# EAGLE design H2BR2 (EAGLE 9.6.1)

## Sheet 1 of 2
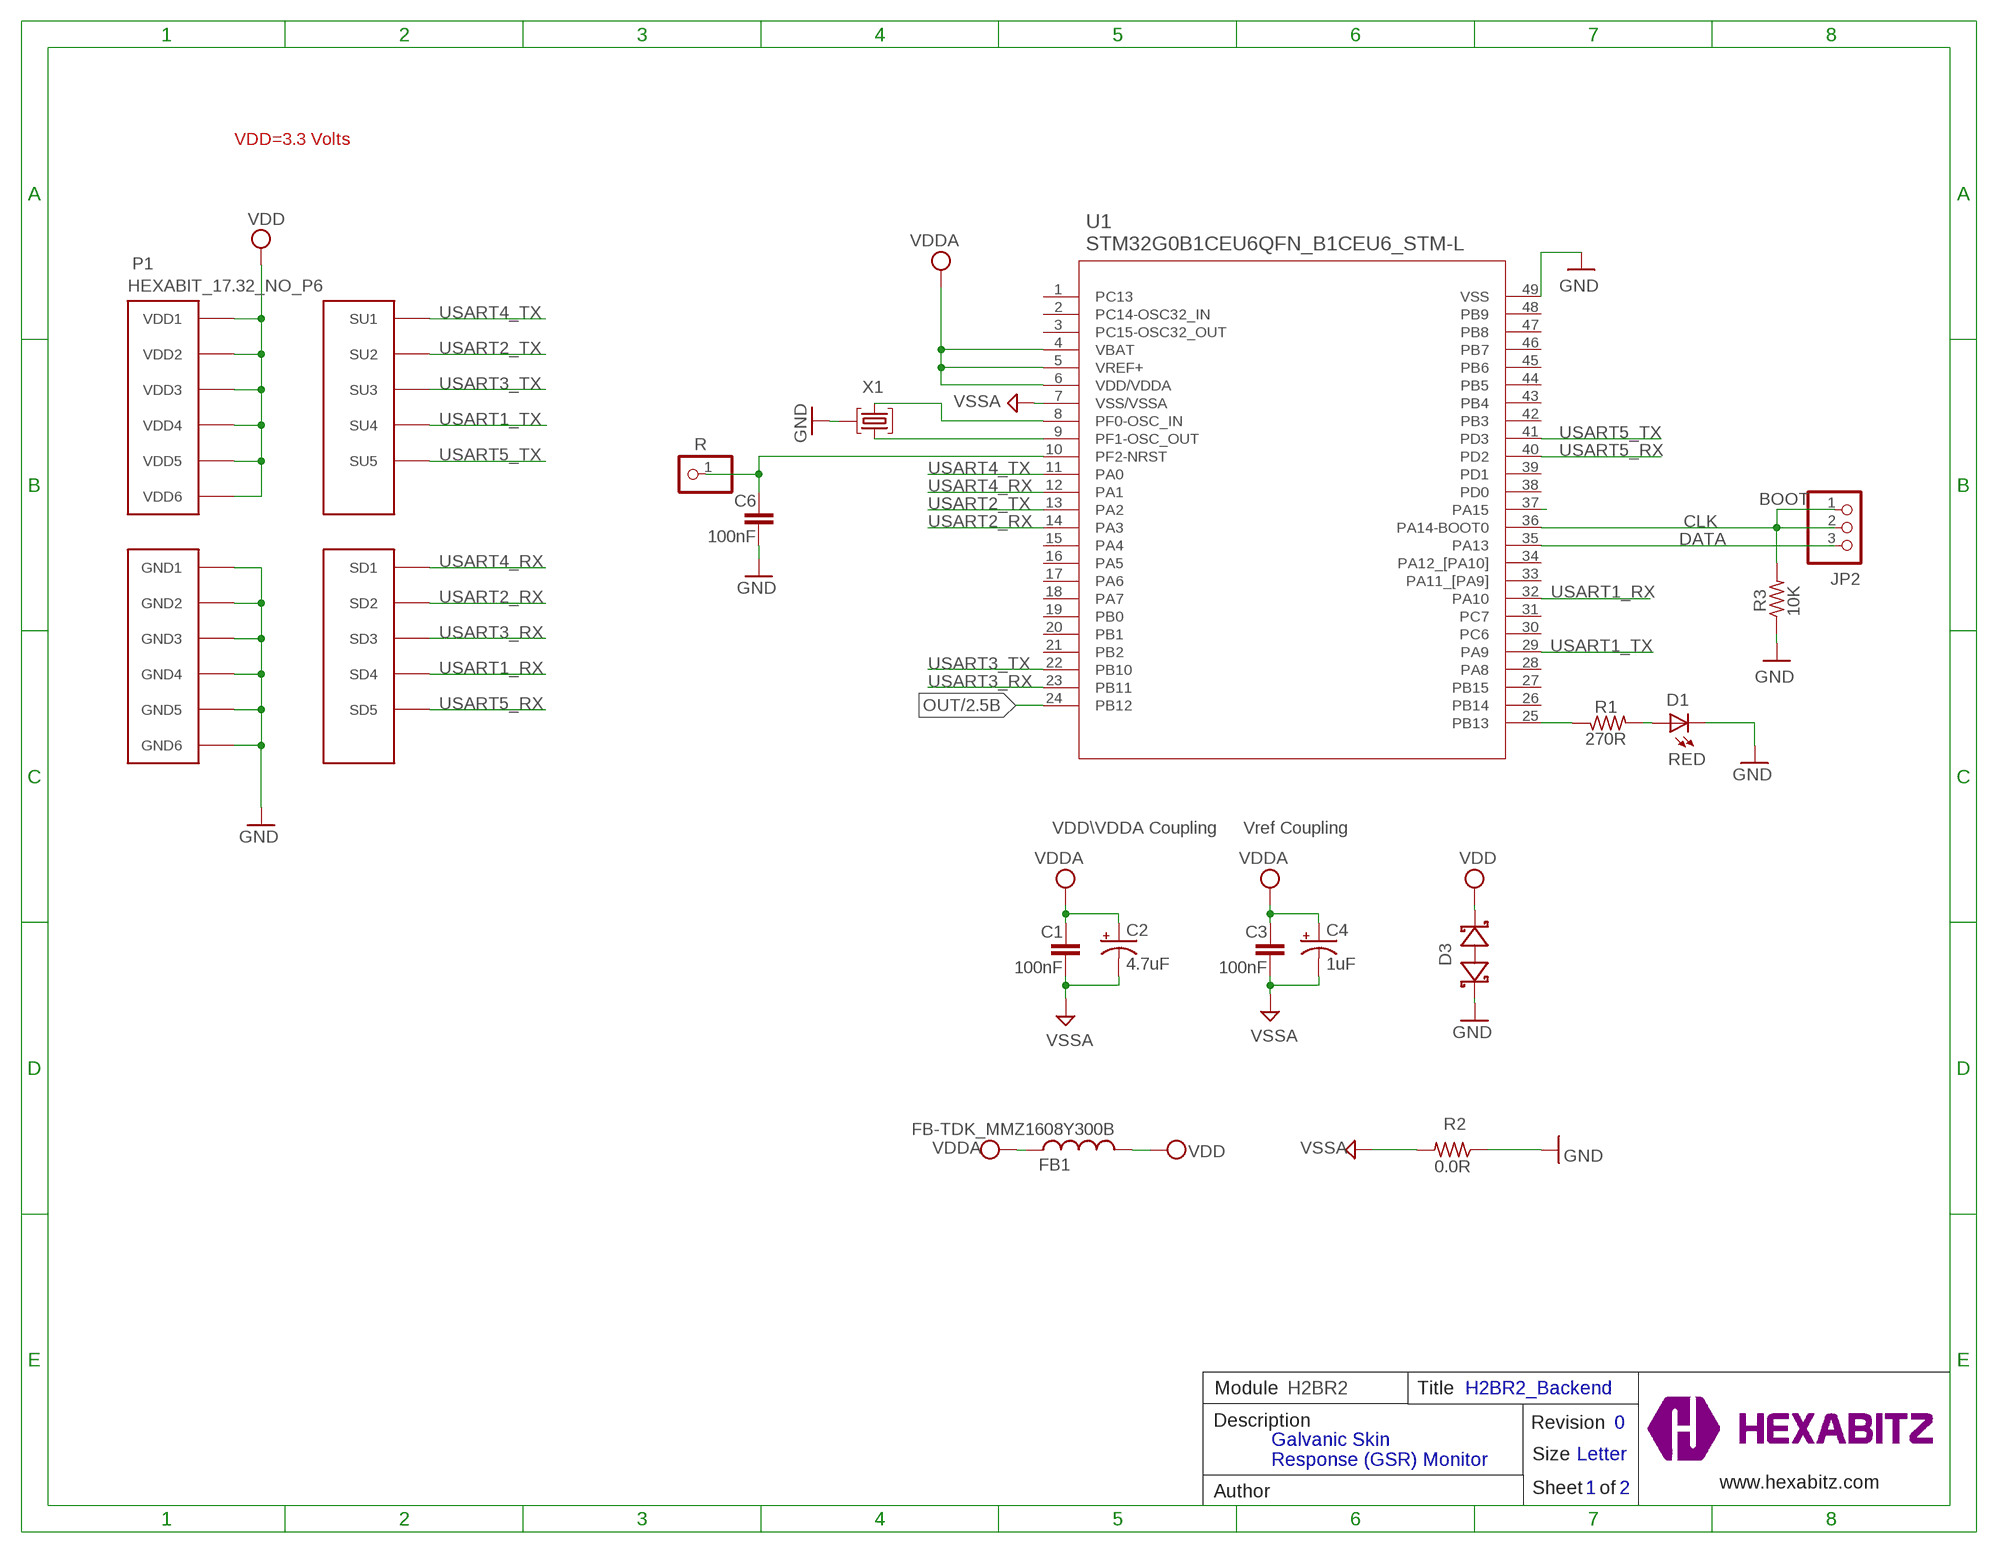
[diagram p0: schematic, sheet 1]

### Parts
C1  100nF  C-0603  [C-0603]
C2  4.7uF  C-0805-POL  [C-0805-POL]
C3  100nF  C-0603  [C-0603]
C4  1uF  C-0805-POL  [C-0805-POL]
C6  100nF  C-0603  [C-0603]
D1  RED  VLMS1300-GS08  [VLMS1300-GS08]
D3  BOURNS_CDSOD323-T03SCBOURNS_CDSOD323-T03SC_0_0  [BOURNS_CDSOD323-T03SC_0]
FB1  FB-TDK_MMZ1608Y300B  FB-0603  [FB-0603]
JP1  R  PINHD-1X1  [1X01]
JP2  PINHD-1X3  [1X03]
P1  HEXABIT_17.32_NO_P6  [HEXABIT_17.32_NO_P6]
R1  270R  R-0603  [R-0603]
R2  0.0R  R-0603  [R-0603]
R3  10K  R-0603  [R-0603]
TRIMBLE-LOGO1  HEXA-LOGO  [HEXA-LOGO]
U1  STM32G0B1CEU6QFN_B1CEU6_STM-L  [QFN_B1CEU6_STM-L]
X1  XTALL_CSTCE8M00G52  [XTALL_CSTCE8M00G52]

### Nets
CLK: JP2.1 JP2.2 R3.2 U1.36(PA14-BOOT0)
DATA: JP2.3 U1.35(PA13)
GND: C6.2 D1.C D3.1(A) P1.PAD_PD7(GND1) P1.PAD_PD8(GND2) P1.PAD_PD9(GND3) P1.PAD_PD10(GND4) P1.PAD_PD11(GND5) P1.PAD_PD12(GND6) R2.1 R3.1 U1.49(VSS) X1.P$2 ; also sheet 2
N$1: R1.1 U1.25(PB13)
N$3: D1.A R1.2
N$4: C6.1 JP1.1 U1.10(PF2-NRST)
N$5: U1.9(PF1-OSC_OUT) X1.P$1
N$6: U1.8(PF0-OSC_IN) X1.P$3
N$9: U1.37(PA15)
OUT: U1.24(PB12) ; also sheet 2
USART1_RX: P1.PAD_PD4(SD4) U1.32(PA10)
USART1_TX: P1.PAD_PU4(SU4) U1.29(PA9)
USART2_RX: P1.PAD_PD2(SD2) U1.14(PA3)
USART2_TX: P1.PAD_PU2(SU2) U1.13(PA2)
USART3_RX: P1.PAD_PD3(SD3) U1.23(PB11)
USART3_TX: P1.PAD_PU3(SU3) U1.22(PB10)
USART4_RX: P1.PAD_PD1(SD1) U1.12(PA1)
USART4_TX: P1.PAD_PU1(SU1) U1.11(PA0)
USART5_RX: P1.PAD_PD5(SD5) U1.40(PD2)
USART5_TX: P1.PAD_PU5(SU5) U1.41(PD3)
VDD: D3.2(C) FB1.2 P1.PAD_PU7(VDD1) P1.PAD_PU8(VDD2) P1.PAD_PU9(VDD3) P1.PAD_PU10(VDD4) P1.PAD_PU11(VDD5) P1.PAD_PU12(VDD6) ; also sheet 2
VDDA: C1.1 C2.1(+) C3.1 C4.1(+) FB1.1 U1.4(VBAT) U1.5(VREF+) U1.6(VDD/VDDA)
VSSA: C1.2 C2.2(-) C3.2 C4.2(-) R2.2 U1.7(VSS/VSSA)
Unconnected: U1.1(PC13) U1.2(PC14-OSC32_IN) U1.3(PC15-OSC32_OUT) U1.15(PA4) U1.16(PA5) U1.17(PA6) U1.18(PA7) U1.19(PB0) U1.20(PB1) U1.21(PB2) U1.26(PB14) U1.27(PB15) U1.28(PA8) U1.30(PC6) U1.31(PC7) U1.33(PA11_[PA9]) U1.34(PA12_[PA10]) U1.38(PD0) U1.39(PD1) U1.42(PB3) U1.43(PB4) U1.44(PB5) U1.45(PB6) U1.46(PB7) U1.47(PB8) U1.48(PB9)

### Notes on the sheet
- VDD=3.3 Volts
- BOOT
- VDD\VDDA Coupling | Vref Coupling
- Module | H2BR2 | Title | H2BR2_Backend
- Description | Revision | 0
- Size | Letter
- Galvanic Skin
  Response (GSR) Monitor
- www.hexabitz.com
- Author | Sheet   of | 1 | 2
- C:/Users/Admin/Desktop/logodraft.bmp

## Sheet 2 of 2
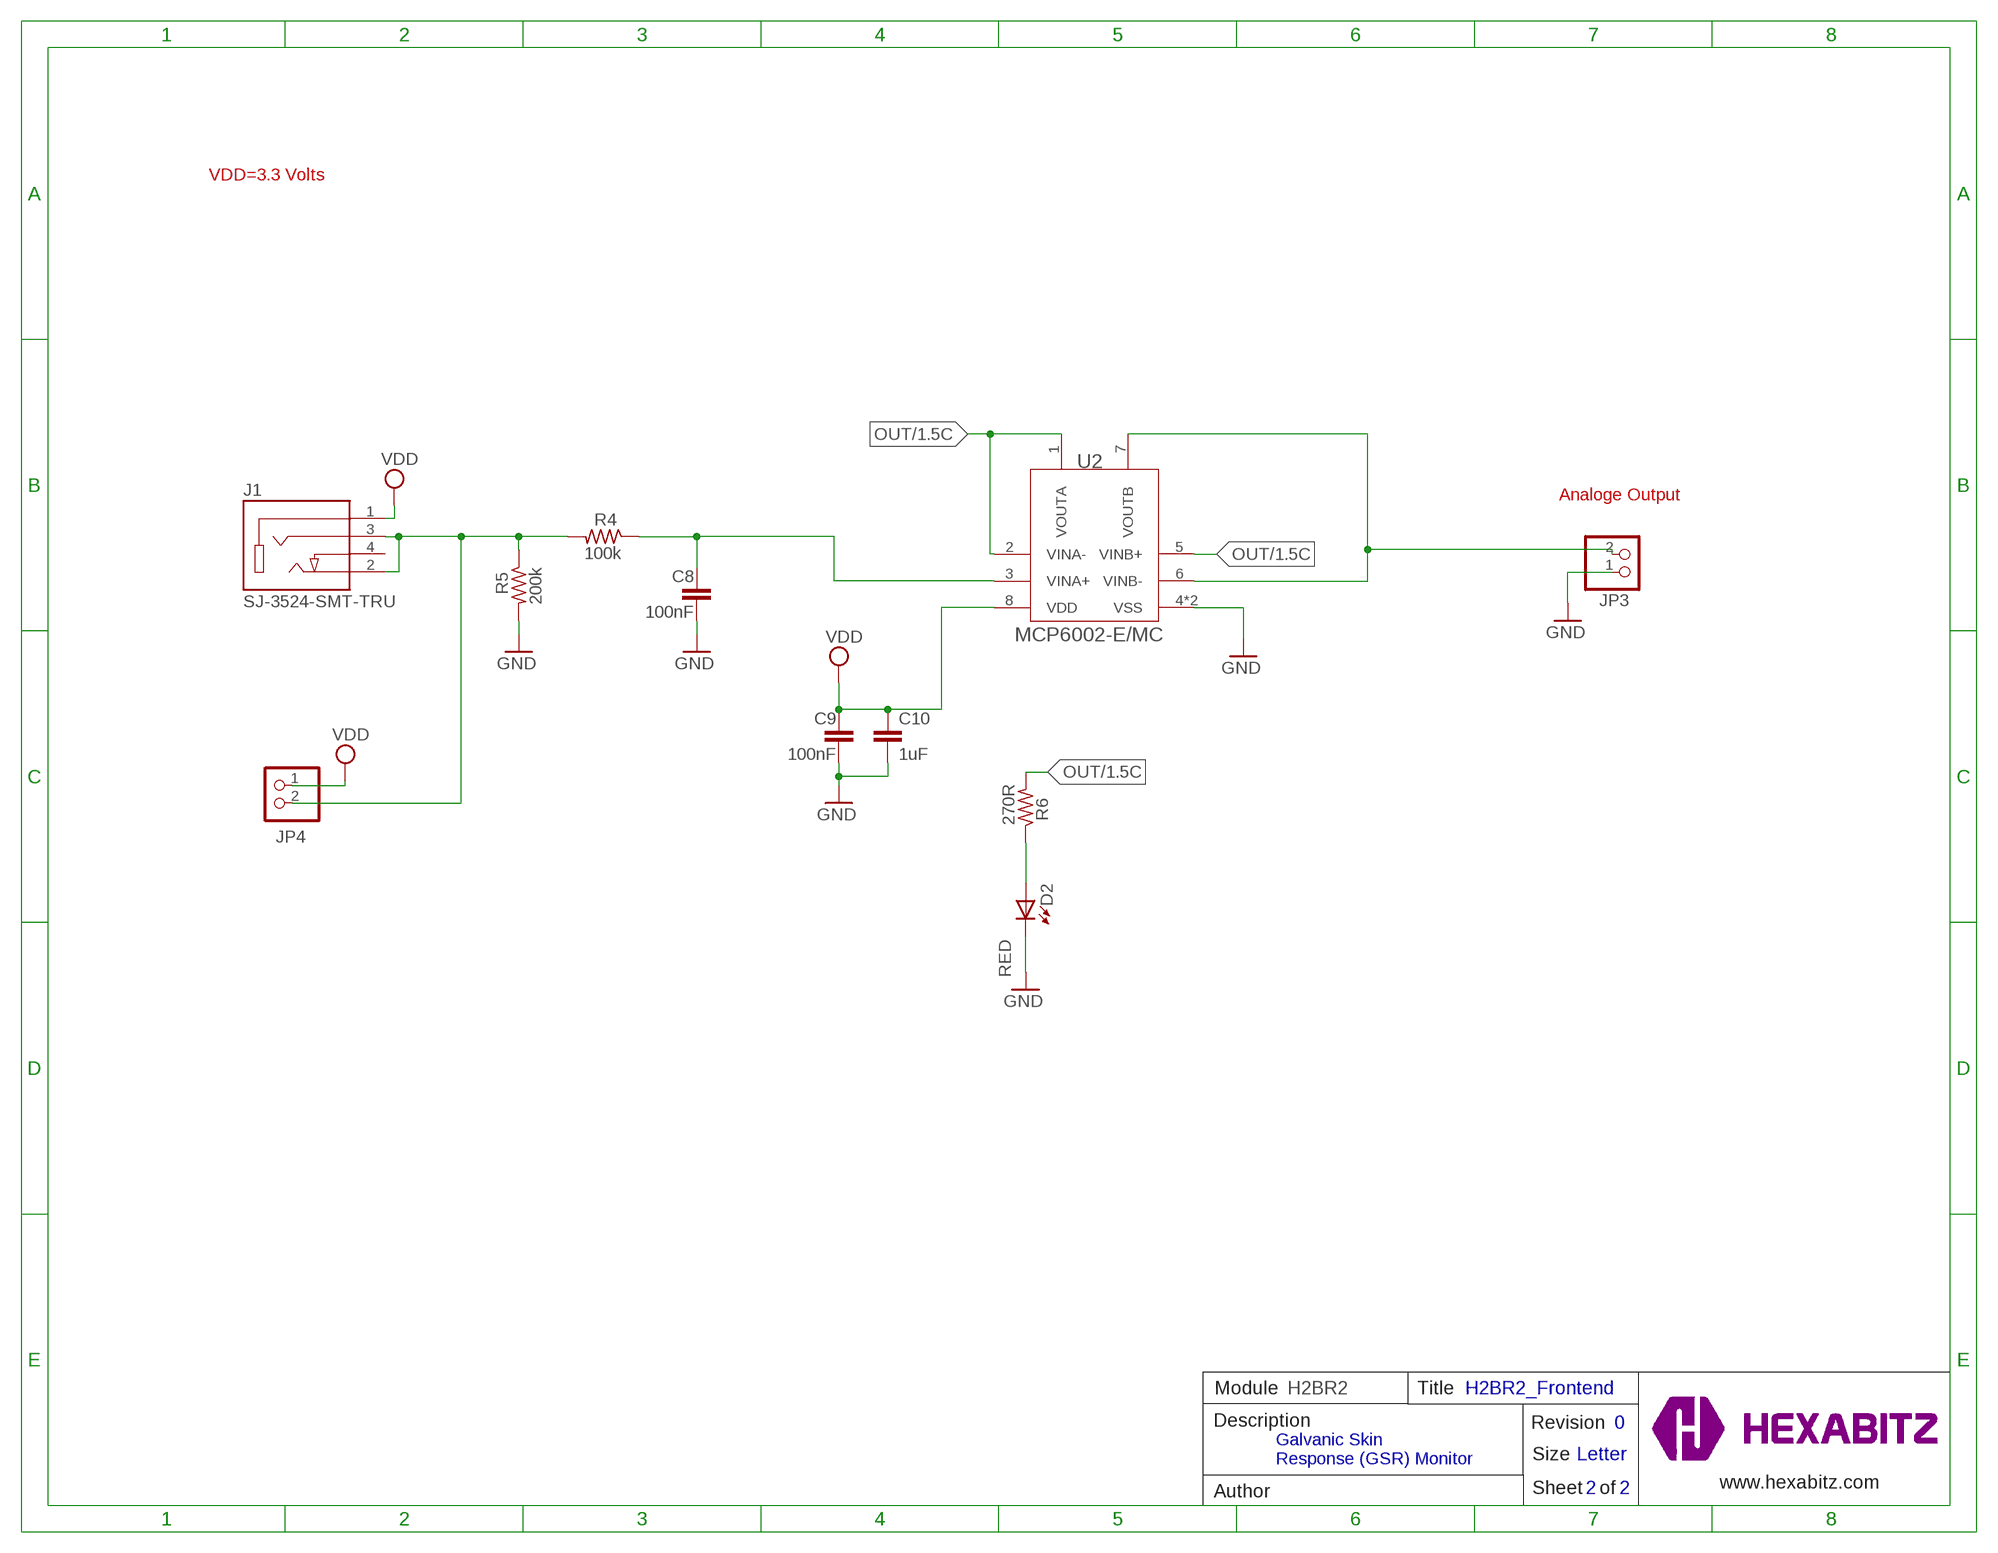
[diagram p1: schematic, sheet 2]

### Parts
C8  100nF  C-0603  [C-0603]
C9  100nF  C-0603  [C-0603]
C10  1uF  C-0805  [C-0805]
D2  RED  VLMS1300-GS08  [VLMS1300-GS08]
J1  SJ-3524-SMT-TRU  [CUI_SJ-3524-SMT]
JP3  PINHD-1X2(ROUND)  [1X02]
JP4  PINHD-1X2(ROUND)  [1X02]
R4  100k  R-0603  [R-0603]
R5  200k  R-0603  [R-0603]
R6  270R  R-0603  [R-0603]
U2  MCP6002-E/MC  [SON50P200X300X100-9N]

### Nets
GND: C8.2 C9.2 C10.2 D2.C JP3.1 R5.2 U2.4(VSS) U2.9(VSS) ; also sheet 1
N$2: JP3.2 U2.6(VINB-) U2.7(VOUTB)
N$8: C8.1 R4.1 U2.3(VINA+)
N$10: J1.2 J1.3 JP4.2 R4.2 R5.1
N$23: D2.A R6.1
OUT: R6.2 U2.1(VOUTA) U2.2(VINA-) U2.5(VINB+) ; also sheet 1
VDD: C9.1 C10.1 J1.1 JP4.1 U2.8(VDD) ; also sheet 1
Unconnected: J1.4

### Notes on the sheet
- VDD=3.3 Volts
- Analoge Output
- Module | H2BR2 | Title | H2BR2_Frontend
- Description | Revision | 0
- Size | Letter
- Galvanic Skin
  Response (GSR) Monitor
- www.hexabitz.com
- Author | Sheet   of | 2 | 2

## Library data of the parts
C1 C3 C6 C8 C9 = HEXABITZ_RCLS:C-0603: CAP CER 10% X7R 0603
C2 C4 = HEXABITZ_RCLS:C-0805-POL: Cap Tant Solid SMD 2012
C10 = HEXABITZ_RCLS:C-0805: CAP CER 10% X7R 0805
D1 D2 = Hexabitz:VLMS1300-GS08: Red 0603 130° Clear 54 mcd 2 V Surface Mount ChipLED ; Octopart Url : http://octopart.com/vlms1300-gs08-vishay-21709201; MFN: Vishay; MPN: VLMS1300-GS08; OCTOPART_URL: https://octopart.com/vlms1300-gs08-vishay-21709201?r=sp&s=_gcP4_q8T1SC6PJQPTQ9yA
D3 = HEXABITZ_RCLS:BOURNS_CDSOD323-T03SC: CDSOD323-TxxSC - TVS Diode Series; DESCRIPTION: Dio Tvs Vwm 03V 500W Bidir Sod323 / Tape & Reel - 7" Reel; MFN: Bourns; MPN: CDSOD323-T03SC; OCTOPART_URL: https://octopart.com/cdsod323-t03sc-bourns-10487153?r=sp
FB1 = HEXABITZ_RCLS:FB-0603: Ferrite Beads Multi-Layer 0603; MFN: TDK; MPN: MMZ1608Y300B; OCTOPART_URL: https://octopart.com/mmz1608y300b-tdk-368280?r=sp&s=cd9_2ZEqQ9q9UNBuQgHAiA
J1 = HEXABITZ_ICs:SJ-3524-SMT-TR: https://octopart.com/search?q=SJ-3524-SMT-TR&currency=USD&specs=0; AVAILABILITY: In Stock; DESCRIPTION: CONN JACK STEREO 3.5MM SMD R/A; MNF: CUI Devices; MPN: SJ-3524-SMT-TR; OCTOPART_URL: https://octopart.com/search?q=SJ-3524-SMT-TR&currency=USD&specs=0; PRICE: 1.03
JP1 = HEXABITZ_USER_INTERFACE_PARTS:PINHD-1X1: PIN HEADER; MFN: TE Connectivity; MPN: 87227-1; OCTOPART_URL: https://octopart.com/87227-1-te+connectivity-39512052?r=sp
JP2 = pinhead:PINHD-1X3: PIN HEADER
JP3 JP4 = pinhead:PINHD-1X2(ROUND): PIN HEADER
P1 = hexabitz_connectors:HEXABIT_?_NO_P6: Hexabitz Hexagon Module Connector Hexagon side length = 17.32mm. The following ports are removed: P6
R1 R3-R6 = HEXABITZ_RCLS:R-0603: Thick Film Resistors - SMD 0603
R2 = HEXABITZ_RCLS:R-0603: Thick Film Resistors - SMD 0603; MFN: Yageo; MPN: RC0603JR-070RL; OCTOPART_URL: https://octopart.com/rc0603jr-070rl-yageo-1241539?r=sp&s=X2NteqRjRNWrnx42Y0aliA; RESISTANCE: 0.0 Ohm
TRIMBLE-LOGO1 = HEXABITZ_USER_INTERFACE_PARTS:HEXA-LOGO: Trimble-Logo
U1 = HEXABITZ_ICs:STM32G0B1CEU6; COPYRIGHT: Copyright (C) 2021 Ultra Librarian. All rights reserved.; MANUFACTURER_PART_NUMBER: STM32G0B1CEU6; MFR_NAME: STMicroelectronics
U2 = HEXABITZ_ICs:MCP6002-E/MC
X1 = Hexabitz:XTALL_CSTCE8M00G52: MURATA CSTCE8M00G52-R0 RESONATOR, SMD, 8MHZ ; Octopart Url : https://octopart.com/cstce8m00g52-r0-murata-7145559; MFN: Murata; MPN: CSTCE8M00G52Z-R0; OCTOPART_URL: https://octopart.com/cstce8m00g52z-r0-murata-17755941?r=sp&s=JDnNJnrHQhyS8Zk4ofFWXw

## Board
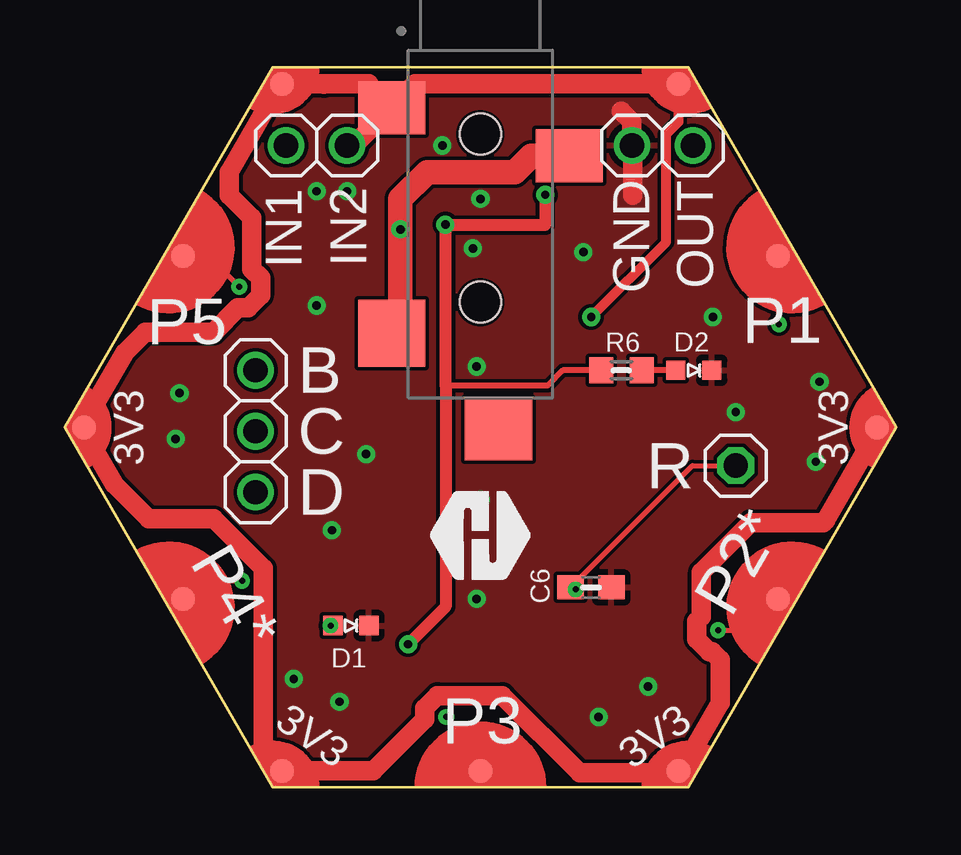
[diagram p2: board, top side]
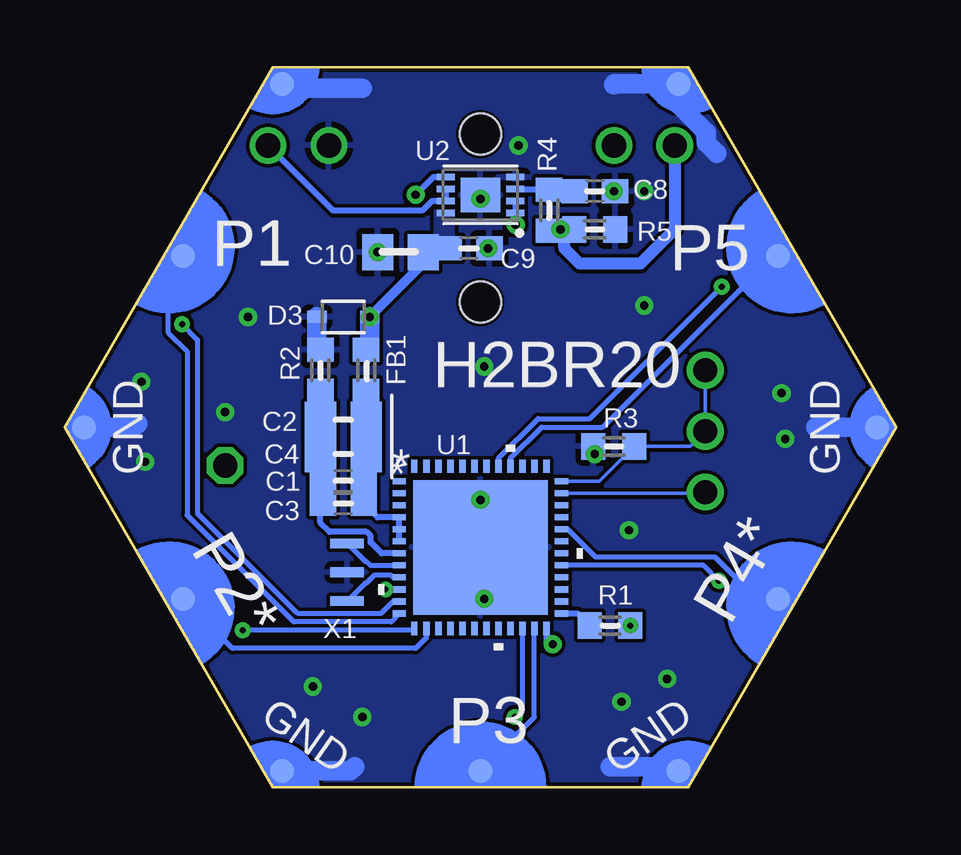
[diagram p3: board, bottom side, seen from below]

Size 34.64 x 30 mm. Coordinates in mm from the lower left corner, seen from the top.
Copper layers (1*16): Top 0.035mm / dielectric 1.5mm / Bottom 0.035mm
Design rules "Ibrahim *": minimum track width 6mil, minimum drill 0.25mm, track to track 6mil, track to pad 6mil, pad to pad 6mil, via to via 6mil, smd to smd 0mil, copper to edge 0.15mm, drill to drill 6mil, minimum pad ring 10mil, minimum via ring 8mil, stop-mask expansion 4mil, vias tented up to drill 24mil, thermal gap 10mil

### Footprints (pad centres in the part's own frame; a part is rotated, then mirrored left to right if it is on the bottom)
C-0603 = smd 1.1 x 1: 1 -0.85,0; 2 0.85,0
C-0805-POL = smd 1.3 x 1.5: 1 -0.95,0; 2 0.95,0
C-0805 = smd 1.3 x 1.5: 1 -0.95,0; 2 0.95,0
VLMS1300-GS08 = smd 0.8 x 0.8: A 0,0.75; C 0,-0.75
BOURNS_CDSOD323-T03SC_0 = smd 0.8 x 0.5: 1 -1.1,0; 2 1.1,0
FB-0603 = smd 1 x 1.1: 1 -0.85,0; 2 0.85,0
CUI_SJ-3524-SMT = smd 2.2 x 2.8: 1 -1.1,-3.7; 3 0.9,3.7 | smd 2.8 x 2.8: 2 8.3,-3.7 | smd 2.6 x 2.8: 4 12.3,0.75 | hole 1.7: 0,0; 7,0
1X01 = drill 1.016 octagon: 1 0,0
1X03 = drill 1.016: 1 -2.54,0; 2 0,0; 3 2.54,0
1X02 = drill 1.016: 1 -1.27,0; 2 1.27,0
HEXABIT_17.32_NO_P6 = smd 1 x 1 bottom: PAD_PD1 12.39,7.15; PAD_PD2 12.39,-7.15; PAD_PD3 0,-14.31; PAD_PD4 -12.39,-7.15; PAD_PD5 -12.39,7.15; PAD_PD7 8.26,14.31; PAD_PD8 16.52,0; PAD_PD9 8.26,-14.31; PAD_PD10 -8.26,-14.31; PAD_PD11 -16.52,0; PAD_PD12 -8.26,14.31 | smd 1 x 1: PAD_PU1 12.39,7.15; PAD_PU2 12.39,-7.15; PAD_PU3 0,-14.31; PAD_PU4 -12.39,-7.15; PAD_PU5 -12.39,7.15; PAD_PU7 8.26,14.31; PAD_PU8 16.52,0; PAD_PU9 8.26,-14.31; PAD_PU10 -8.26,-14.31; PAD_PU11 -16.52,0; PAD_PU12 -8.26,14.31
R-0603 = smd 1 x 1.1: 1 -0.85,0; 2 0.85,0
QFN_B1CEU6_STM-L = smd 0.55 x 0.254: 1 -3.38,2.751; 2 -3.38,2.251; 3 -3.38,1.75; 4 -3.38,1.25; 5 -3.38,0.75; 6 -3.38,0.25; 7 -3.38,-0.25; 8 -3.38,-0.75; 9 -3.38,-1.25; 10 -3.38,-1.75; 11 -3.38,-2.251; 12 -3.38,-2.751; 25 3.38,-2.751; 26 3.38,-2.251; 27 3.38,-1.75; 28 3.38,-1.25; 29 3.38,-0.75; 30 3.38,-0.25; 31 3.38,0.25; 32 3.38,0.75; 33 3.38,1.25; 34 3.38,1.75; 35 3.38,2.251; 36 3.38,2.751 | smd 0.254 x 0.55: 13 -2.751,-3.38; 14 -2.251,-3.38; 15 -1.75,-3.38; 16 -1.25,-3.38; 17 -0.75,-3.38; 18 -0.25,-3.38; 19 0.25,-3.38; 20 0.75,-3.38; 21 1.25,-3.38; 22 1.75,-3.38; 23 2.251,-3.38; 24 2.751,-3.38; 37 2.751,3.38; 38 2.251,3.38; 39 1.75,3.38; 40 1.25,3.38; 41 0.75,3.38; 42 0.25,3.38; 43 -0.25,3.38; 44 -0.75,3.38; 45 -1.25,3.38; 46 -1.75,3.38; 47 -2.251,3.38; 48 -2.751,3.38 | smd 5.6 x 5.6: 49 0,0
SON50P200X300X100-9N = smd 0.75 x 0.27: 1 -1.45,0.75; 2 -1.45,0.25; 3 -1.45,-0.25; 4 -1.45,-0.75; 5 1.45,-0.75; 6 1.45,-0.25; 7 1.45,0.25; 8 1.45,0.75 | smd 1.65 x 1.45: 9 0,0
XTALL_CSTCE8M00G52 = smd 1.4 x 0.4: P$1 0,1.2; P$2 0,0; P$3 0,-1.2

### Placement (x,y rotation side)
C1  23.04,12.78 180 bottom
C2  23.04,15.32 180 bottom
C3  23.04,11.82 180 bottom
C4  23.04,13.89 180 bottom
C6  21.92,8.33 0 top
C8  12.56,24.84 0 bottom
C9  17.8,22.46 0 bottom
C10  20.65,22.3 180 bottom
D1  11.92,6.74 90 top
D2  26.21,17.38 90 top
D3  23.04,19.6 0 bottom
FB1  22.08,17.38 90 bottom
J1  17.32,27.22 270 top
JP1  27.96,13.41 0 top
JP2  7.95,14.84 270 top
JP3  24.9,26.75 0 top
JP4  10.49,26.75 180 top
P1  17.32,15 0 top
R1  11.92,6.74 0 bottom
R2  23.99,17.38 270 bottom
R3  11.76,14.21 0 bottom
R4  14.46,24.05 270 bottom
R5  12.56,23.25 0 bottom
R6  23.19,17.38 180 top
TRIMBLE-LOGO1  17.32,8.65 0 top
U1  17.32,10 0 bottom
U2  17.32,24.68 180 bottom
X1  22.88,8.97 180 bottom

### Tracks (layer width: path | path; a pad name or v marks a point on that pad's centre or on a via)
CLK
  Bottom 0.152: U1.36 12.37,12.75 R3.2 8.59,14.21 JP2.2 JP2.1
DATA
  Bottom 0.152: U1.35 8.01,12.25 JP2.3
GND  (via drill 0.35 pad 0.75)
  Top 0.813: 23.67,24.68 23.67,26.71 JP3.1 23.63,27.74 23.19,28.18
  Bottom 0.813: D3.1 24.14,18.38 R2.1 | U1.49 17.16,9.84 v17.16,7.86 | 11.76,29.29 11.74,29.31 P1.PAD_PD12 9.06,28.45 7.9,27.29 7.9,26.86 7.48,26.43 | P1.PAD_PD7 25.4,29.13 22.24,29.13 | P1.PAD_PD8 31.77,15 31.61,15.16 | P1.PAD_PD9 22.74,0.69 22.56,0.87 | P1.PAD_PD10 9.24,0.87 11.92,0.87 | P1.PAD_PD11 3.35,15
  other vias: 17.32,11.98 11.13,10.71 4.62,14.52 4.78,16.43 10.49,20.08 17.16,17.54 15.73,26.75 12.56,13.89 22.24,2.93 24.3,4.2 11.45,3.57 9.54,4.52 17,22.46 31.45,16.9 31.29,13.57 17.32,24.52 21.61,22.3 27,19.6 27.96,15.63 11.76,24.84 10.49,24.84
  pour Bottom (rank 2): 8.68,0.01 26.04,0.01 34.68,14.99 26.02,29.99 8.63,29.99 0,15.05
  pour Top (rank 2): 8.63,0.01 26.06,0.01 34.65,14.98 26.01,30.02 8.69,29.99 0.01,14.95
N$1
  Bottom 0.254: U1.25 13.28,7.25 R1.1
N$2
  Bottom 0.254: JP3.2 23.46,24.04 19.75,24.04 19.35,24.43 U2.7 U2.6
N$3  (via drill 0.25 pad 0.55)
  Top 0.254: R1.2 D1.A
  other vias: 11.07,6.74
N$4  (via drill 0.25 pad 0.55)
  Top 0.203: JP1.1 26.15,13.41 C6.1 21.16,8.25 v21.28,8.25
  Bottom 0.203: U1.10 v21.28,8.25
N$5
  Bottom 0.203: U1.9 20.96,8.75 21.04,8.83 21.75,8.83 22.07,8.51 22.13,8.51 X1.P$1
N$6
  Bottom 0.203: X1.P$3 22.13,9.42 22.07,9.42 21.9,9.25 U1.8
N$8
  Bottom 0.254: U2.3 14.5,24.93 | R4.1 13.46,24.9 C8.1
  Bottom 0.305: 14.5,24.93 R4.1
N$10  (via drill 0.35 pad 0.75)
  Top 0.813: J1.2 13.87,19.17 13.99,19.17
  Top 1.016: 13.99,19.17 v13.99,23.25 13.99,24.52 15.1,25.64 18.75,25.64 19.44,26.32 J1.3
  Bottom 0.254: R5.1 13.83,23.25 v13.99,23.25 14.04,23.2 R4.2
  Bottom 0.508: JP4.2 9.22,23.25 10.65,21.83 13.19,21.83 13.83,22.46 13.83,23.25
N$23
  Top 0.254: 25.63,17.38 D2.A R6.1
OUT  (via drill 0.35 pad 0.75)
  Top 0.254: R6.2 20.76,17.38 20.12,16.75 15.87,16.75
  Top 0.508: v15.86,23.45 15.87,23.43 | 15.87,23.43 20.02,23.43 v20.02,24.69 | v14.31,5.97 15.87,7.53 15.87,16.75 15.87,23.43
  Bottom 0.254: U2.2 U2.1 15.87,23.47 v15.86,23.45 | U2.5 19.28,25.43 v20.02,24.69 | U1.24 14.57,5.91 14.47,5.81
  Bottom 0.305: v14.31,5.97 14.47,5.81
USART1_RX
  Bottom 0.203: U1.32 13.68,10.75 12.53,9.6 7.56,9.6 5.8,7.85 P1.PAD_PD4
USART1_TX  (via drill 0.25 pad 0.55)
  Top 0.203: P1.PAD_PU4 5.69,8.61 v7.38,8.61
  Bottom 0.203: v7.38,8.61 8.02,9.25 U1.29
USART2_RX
  Bottom 0.203: U1.14 19.57,6.24 20.02,5.79 27.65,5.79 P1.PAD_PD2
USART2_TX  (via drill 0.25 pad 0.55)
  Top 0.203: v27.22,6.55 28.41,6.55 P1.PAD_PU2
  Bottom 0.203: U1.13 20.14,6.55 v27.22,6.55
USART3_RX
  Bottom 0.203: P1.PAD_PD3 15.66,2.35 15.65,2.35 15.07,2.93 U1.23
USART3_TX  (via drill 0.25 pad 0.55)
  Top 0.203: v15.89,2.93 17.32,1.51 P1.PAD_PU3
  Bottom 0.203: U1.22 15.57,3.26 v15.89,2.93
USART4_RX
  Bottom 0.203: U1.12 21.05,6.9 25.1,6.9 29.54,11.35 29.54,18.17 30.34,18.97 30.34,21.51 P1.PAD_PD1
USART4_TX  (via drill 0.25 pad 0.55)
  Top 0.203: v29.76,19.3 29.76,22.1 P1.PAD_PU1
  Bottom 0.203: v29.76,19.3 29.12,18.66 29.12,11.43 24.95,7.26 21.45,7.26 21.04,7.67 20.96,7.75 U1.11
USART5_RX
  Bottom 0.203: U1.40 16.07,13.71 14.77,15.01 12.23,15.01 5.09,22.15 P1.PAD_PD5
USART5_TX  (via drill 0.25 pad 0.55)
  Top 0.203: v7.27,20.86 5.98,22.15 P1.PAD_PU5
  Bottom 0.203: U1.41 16.57,13.71 14.92,15.37 12.77,15.37 v7.27,20.86
VDD  (via drill 0.35 pad 0.75)
  Top 0.406: P1.PAD_PU7 25.58,27.73 25.06,27.21 25.06,22.72 D3.2
  Top 0.813: 10.81,29.31 P1.PAD_PU12 8.83,29.08 6.84,25.64 6.84,24.68 7.79,23.73 7.79,21.59 8.16,21.23 8.16,20.5 7.64,19.98 7.22,19.98 6.21,18.97 3.35,18.97 2.5,18.12 0.8,15.17 P1.PAD_PU11 0.8,14.83 2.07,12.63 3.51,11.19 6.21,11.19 8.27,9.13 8.27,1.89 8.83,0.92 P1.PAD_PU10 12.85,0.69 15,2.84 15,3.3 15.52,3.82 18.23,3.82 21.45,0.61 25.5,0.61 P1.PAD_PU9 25.81,0.92 27.32,3.54 27.32,5.32 26.98,5.66 26.85,5.66 26.33,6.18 26.33,6.91 26.53,7.11 26.53,8.97 28.59,11.03 31.61,11.03 31.7,11.13 33.84,14.83 P1.PAD_PU8 | 10.81,29.31 12.67,29.31 12.67,29.27 J1.1 | 10.79,29.29 10.81,29.31 | J1.1 14.61,29.31 P1.PAD_PU7 | J1.1 12.04,26.75 JP4.1
  Bottom 0.406: D3.2 19.7,21.83 C10.1 19.55,22.46 C9.1
  Bottom 0.813: FB1.2 21.94,18.38 D3.2
  other vias: 21.94,19.6
  pour Bottom (no thermals): 18.43,24.05 18.43,22.3 19.23,22.3 19.23,24.05
VDDA
  Bottom 0.203: U1.5 U1.4
  Bottom 0.254: U1.6 U1.4 21.61,11.25 C3.1 C1.1 22.19,13.79 C4.1 C2.1 FB1.1
VSSA
  Bottom 0.254: U1.7 21.44,9.75 21.9,10.21 21.9,10.48 22.06,10.65 23.6,10.65 23.99,11.03 23.99,11.72 C3.2 C1.2 23.98,12.88 C4.2 C2.2 R2.2

### Text on the board
tPlace: IN1 | IN2 | GND | OUT | P5 | P1 | 3V3 | 3V3 | P2* | P4* | P3 | 3V3 | 3V3
bPlace: P5 | P1 | H2BR20 | GND | GND | P4* | P2* | P3 | GND | GND
tNames: B | C | R | D
bNames: *